# EasyEDA Pro project E-SportsV0.2.epro, schematic Schematic2_1
Board Name: Board2_1; Create Date: 2025-07-02; Page Name: P1; Project Name: E-SportsV0.2; Schematic Name: Schematic2_1; Update Date: 2025-07-02; Company: 嘉立创EDA; Page Size: A4; Version: V1.0
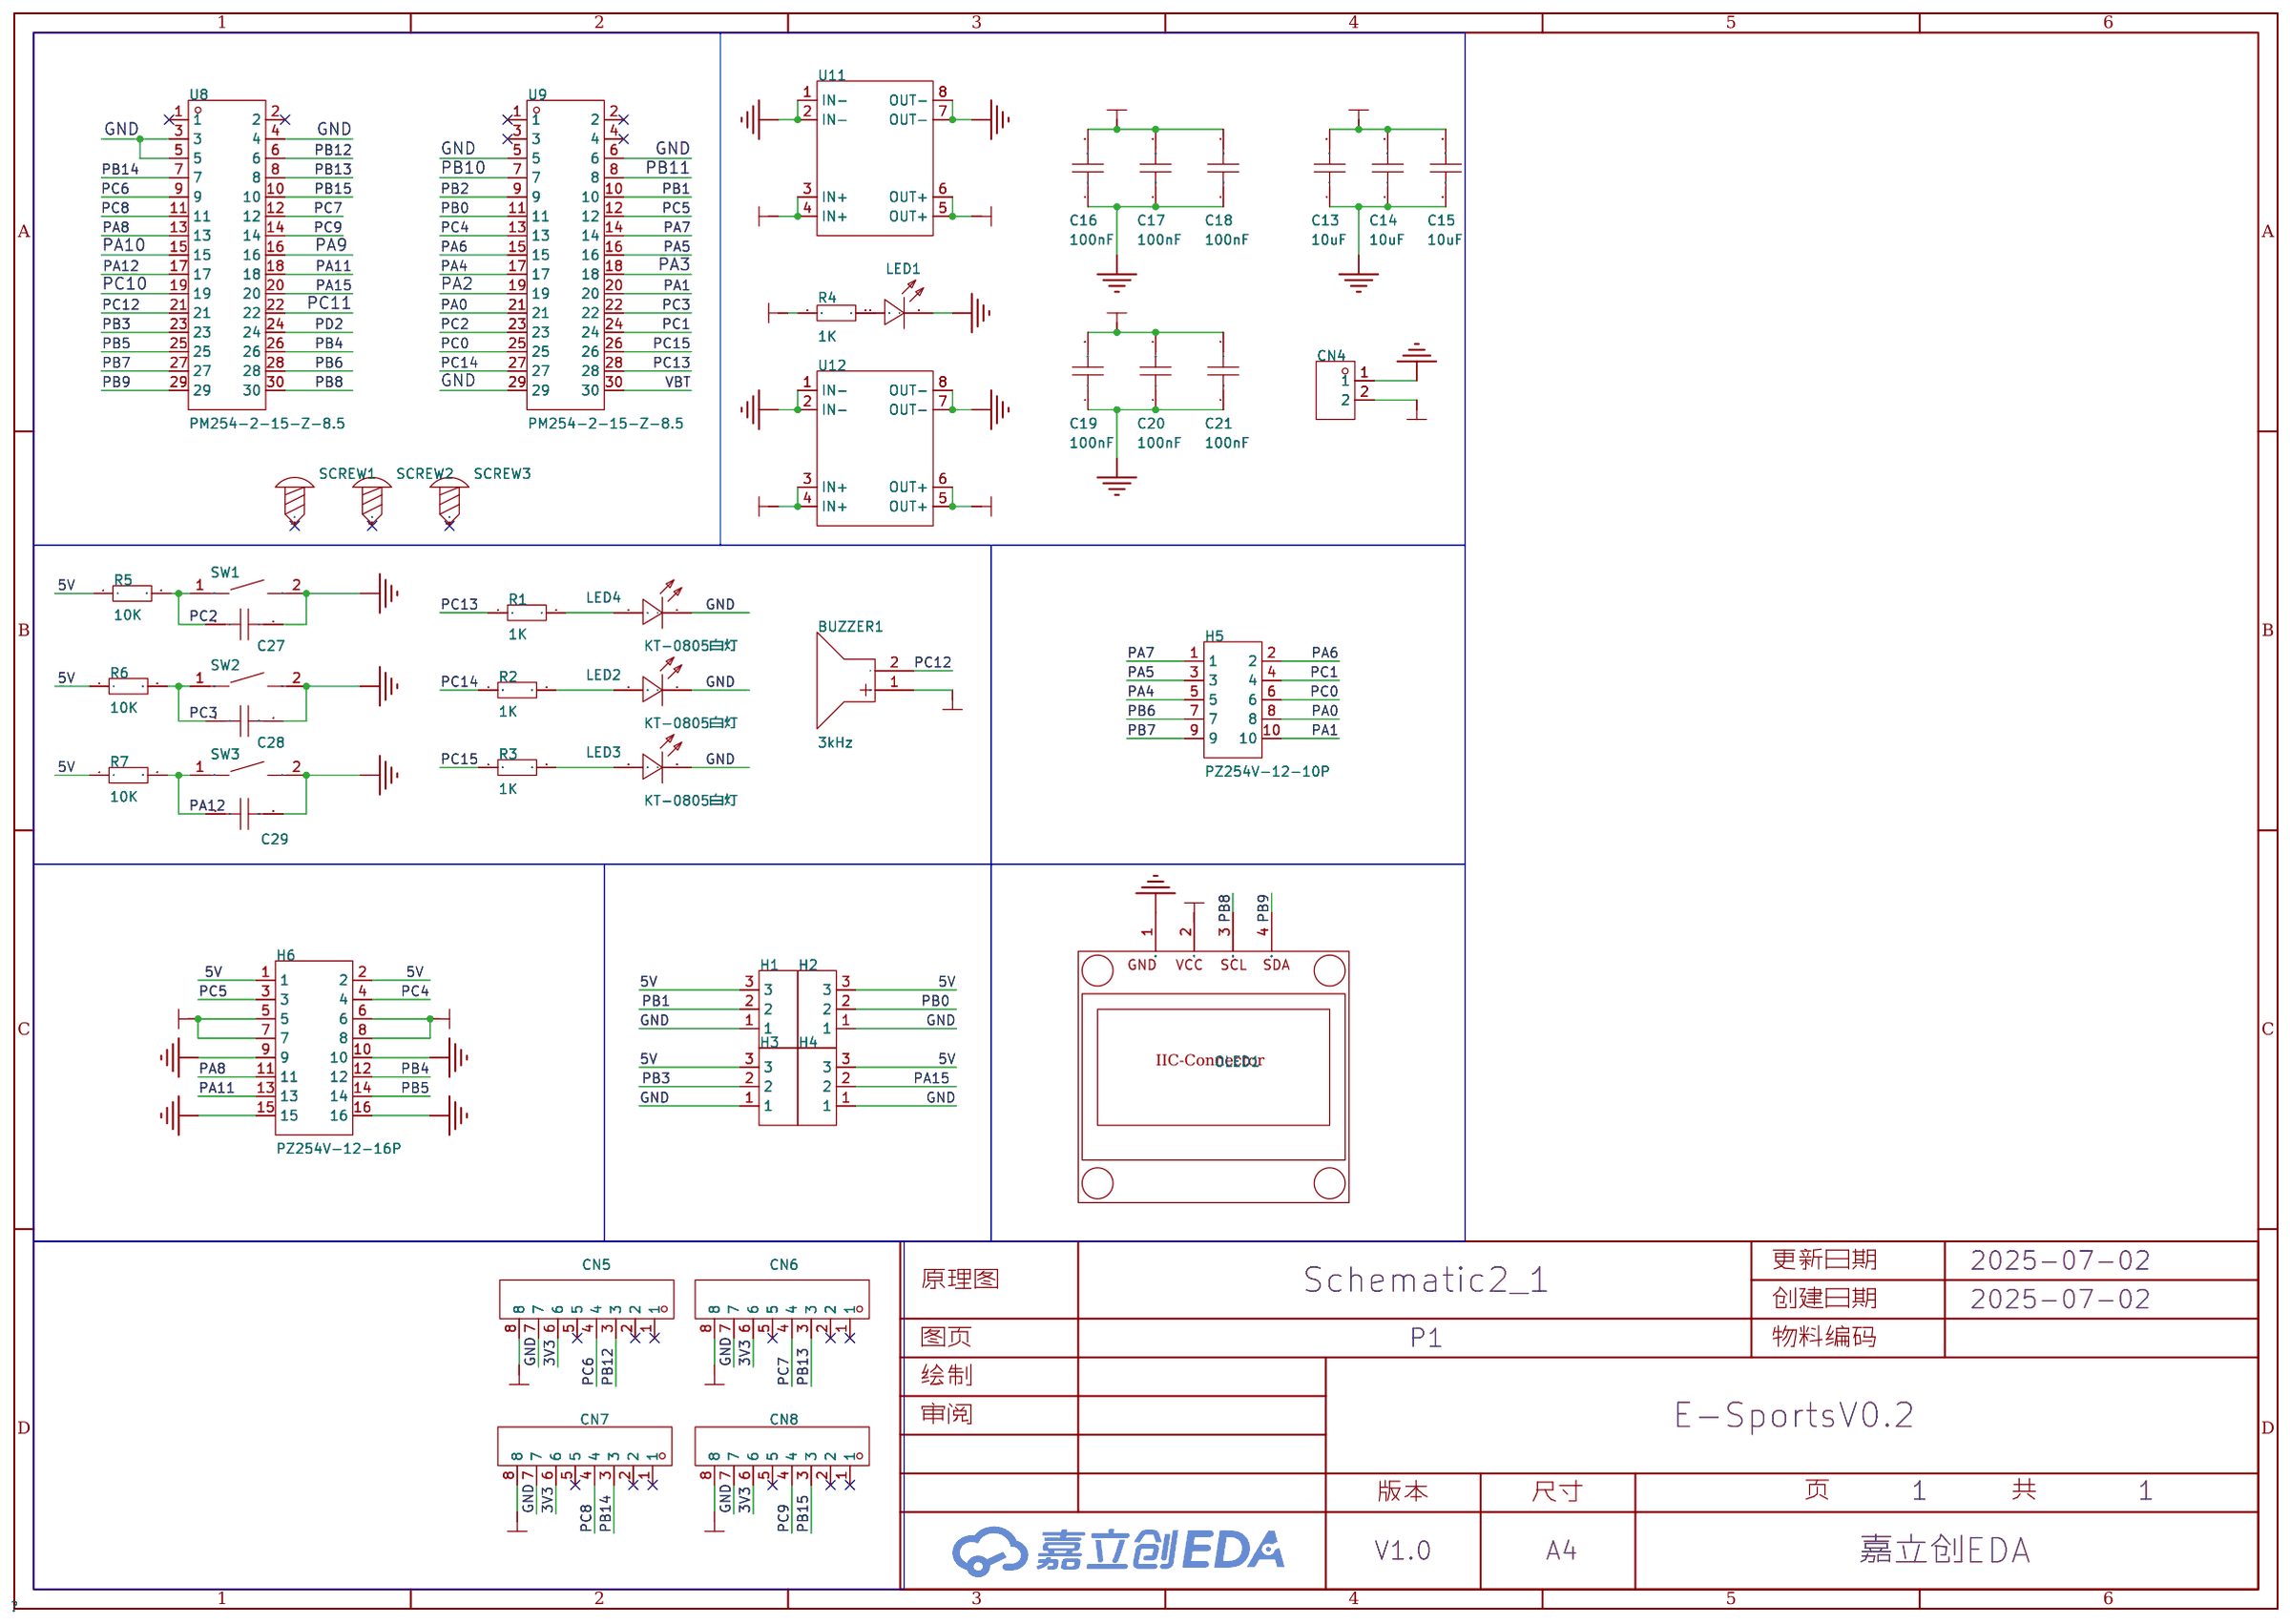
[diagram p1: schematic sheet]

## Parts
BUZZER1  3kHz  [BUZ-TH_BD9.0-P5.00-D0.6-FD]
C13  10uF  [C0805]
C14  10uF  [C0805]
C15  10uF  [C0805]
C16  100nF  [C0603]
C17  100nF  [C0603]
C18  100nF  [C0603]
C19  100nF  [C0603]
C20  100nF  [C0603]
C21  100nF  [C0603]
C27  100nF  [C0603]
C28  100nF  [C0603]
C29  100nF  [C0603]
CN4  DB2ERC-3.81-2P-GN  [CONN-TH_2P-P3.81_DB2ERC-3.81-2P]
CN5  ZX-XH2.54-8PZZ  [CONN-TH_8P-P2.50-XH2.54-8P]
CN6  ZX-XH2.54-8PZZ  [CONN-TH_8P-P2.50-XH2.54-8P]
CN7  ZX-XH2.54-8PZZ  [CONN-TH_8P-P2.50-XH2.54-8P]
CN8  ZX-XH2.54-8PZZ  [CONN-TH_8P-P2.50-XH2.54-8P]
H1  PZ254V-11-03P  [HDR-TH_3P-P2.54-V-M]
H2  PZ254V-11-03P  [HDR-TH_3P-P2.54-V-M]
H3  PZ254V-11-03P  [HDR-TH_3P-P2.54-V-M]
H4  PZ254V-11-03P  [HDR-TH_3P-P2.54-V-M]
H5  PZ254V-12-10P  [HDR-TH_10P-P2.54-V-M-R2-C5-S2.54]
H6  PZ254V-12-16P  [HDR-TH_16P-P2.54-V-M-R2-C8-S2.54]
LED1  KT-0805W  [LED0805-R-RD]
LED2  KT-0805白灯  [LED0805-R-RD]
LED3  KT-0805白灯  [LED0805-R-RD]
LED4  KT-0805白灯  [LED0805-R-RD]
OLED1  0.96OLED_4P_MODULE_JX  [0.96OLED_4P]
R1  1K  [R0603]
R2  1K  [R0603]
R3  1K  [R0603]
R4  1K  [R0603]
R5  10K  [R0603]
R6  10K  [R0603]
R7  10K  [R0603]
SCREW1  -  [M3螺丝]
SCREW2  -  [M3螺丝]
SCREW3  -  [M3螺丝]
SW1  TS-1088-AR02016  [SW-SMD_L3.9-W3.0-P4.45]
SW2  TS-1088-AR02016  [SW-SMD_L3.9-W3.0-P4.45]
SW3  TS-1088-AR02016  [SW-SMD_L3.9-W3.0-P4.45]
U8  PM254-2-15-Z-8.5  [HDR-TH_30P-P2.54-V-F-R2-C15-S2.54-2]
U9  PM254-2-15-Z-8.5  [HDR-TH_30P-P2.54-V-F-R2-C15-S2.54-2]
U11  -  [MP1584模块]
U12  -  [MP1584模块]

## Library data of the parts
BUZZER1 = HNB09A03: 驱动方式:有源(内含驱动线路);构造类型:电磁式;频率:3kHz;声压(SPL):85dB;; LCSC Part Name: 电磁式有源一体蜂鸣器HNB09A03; Supplier Part: C96102; Manufacturer: 华能; Supplier Footprint: 插件,D=9mm; JLCPCB Part Class: 扩展库; Datasheet: https://atta.szlcsc.com/upload/public/pdf/source/20241128/61C4C8C3938BB25F7C38FBE94CCE8DCF.pdf; Supplier: LCSC; Driver Circuitry: 有源(内含驱动线路); Technology: 电磁式; Voltage - Supply: 1.5V~4.5V; Current Consumption: 30mA; Sound Pressure Level(SPL): 85dB; Diameter(φD): 9mm; Height: 5.5mm; Operating Temperature: -20℃~+70℃
C13-C15 = CL21A106KAYNNNE_C15850: 容值:10uF;精度:±10%;额定电压:25V;材质(温度系数):X5R;; LCSC Part Name: 10uF ±10% 25V; Supplier Part: C15850; Manufacturer: SAMSUNG(三星); Manufacturer Part: CL21A106KAYNNNE; Supplier Footprint: 0805; JLCPCB Part Class: 基础库; Datasheet: https://atta.szlcsc.com/upload/public/pdf/source/20160218/1457707763339.pdf; Supplier: LCSC; Tolerance: ±10%; Voltage Rated: 25V; Temperature Coefficient: X5R
C16-C21 C27-C29 = CAP_0603: Supplier Footprint: 0603
CN4 = DB2ERC-3.81-2P-GN: 连接器类型:板端/插座-闭口;结构:1x2P;间距:3.81mm;颜色:绿色;安装方式:弯针;排数:1;每排PIN数:2;额定电流:10A;额定电压:250V;工作温度范围:-40℃~+105℃;; LCSC Part Name: 3.81mm 1x2P 排数:1 每排P数:2; Supplier Part: C395684; Manufacturer: DORABO(地博电气); Supplier Footprint: 弯插,P=3.81mm; JLCPCB Part Class: 扩展库; Datasheet: https://atta.szlcsc.com/upload/public/pdf/source/20221115/4E217E7D538220F8720C137D6A05E519.pdf; Supplier: LCSC; Connector Type: 板端/插座-闭口; Structure: 1x2P; Pitch: 3.81mm; Color: 绿色; Mounting Style: 弯针; Number of Pins: 2P; Number of Rows: 1; Number of PINs Per Row: 2; Current Rating (Max): 10A; Voltage Rating (Max): 250V; Operating Temperature Range: -40℃~+105℃
CN5-CN8 = ZX-XH2.54-8PZZ: 插针结构:1x8P;间距:2.5mm;安装方式:直插;参考系列:XH;总PIN数:8P;排数:1;每排PIN数:8;行距:-;额定电流:3A;触头材质:黄铜;触头镀层:锡;工作温度范围:-25℃~+85℃;; LCSC Part Name: 1x8P 间距:2.5mm 直插 系列:XH; Supplier Part: C7429638; Manufacturer: Megastar(兆星); Supplier Footprint: 插件,P=2.5mm; Datasheet: https://atta.szlcsc.com/upload/public/pdf/source/20230619/688603DEA58996C00B1F33C46797D2C3.pdf; Supplier: LCSC; Pins Structure: 1x8P; Pitch: 2.5mm; Mounting Type: 直插; Reference Series: XH; Number of Pins: 8P; Number of Rows: 1; Number of PINs Per Row: 8; Rated Current: 3A; Contact Material: 黄铜; Contact Plating: 锡; Operating Temperature: -25℃~+85℃; Rated Voltage (Max): 250V; Plastic Material: PA66; Flame Retardant Rating: UL94V-0; Color: 白色; Z-Height of the Board: 7mm; X-Length of Bottom Edge on Board (Spacing Line): 22.5mm; Y-Width of Bottom Edge on Board: 5.9mm
H1-H4 = PZ254V-11-03P: 插针结构:1x3P;间距:2.54mm;行距:-;圆针/方针:方针;安装方式:直插;排数:单排;总PIN位数:3P;额定电流:3A;额定电压:250V;配合针长度:6mm;塑高:2.5mm;端接针长度:3mm;工作温度:-40℃~+105℃;颜色:黑色;; LCSC Part Name: 1x3P 间距:2.54mm 方针 直插; Supplier Part: C2937625; Manufacturer: XFCN(兴飞); Supplier Footprint: 插件,P=2.54mm; JLCPCB Part Class: 扩展库; Datasheet: https://atta.szlcsc.com/upload/public/pdf/source/20200309/C492402_8335C3D49C4E4C618838D59BB1D024C1.pdf; Supplier: LCSC; Pin Structure: 1x3P; Pitch: 2.54mm; Circluar Pins/Square Pins: 方针; Mounting Type: 直插; Number of Rows: 单排; Number of Pins: 3P; Current Rating: 3A; Voltage Rating (Max): 250V; Length of Mating Pin: 6mm; Insulation Height: 2.5mm; Length of End Connection Pin: 3mm; Operating Temperature: -40℃~+105℃; Color: 黑色
H5 = PZ254V-12-10P: 插针结构:2x5P;间距:2.54mm;行距:2.54mm;圆针/方针:方针;安装方式:直插;排数:双排;总PIN位数:10P;额定电流:-;额定电压:-;配合针长度:6mm;塑高:2.5mm;端接针长度:3mm;触头材质:黄铜;触头镀层:-;工作温度:-40℃~+105℃;颜色:黑色;; LCSC Part Name: 2x5P 间距:2.54mm 方针 直插; Supplier Part: C492422; Manufacturer: XFCN(兴飞); Supplier Footprint: 插件,P=2.54mm; JLCPCB Part Class: 扩展库; Datasheet: https://atta.szlcsc.com/upload/public/pdf/source/20200309/C492422_5020CEA01BE7051F9EA9DD81AB0A25E3.pdf; Supplier: LCSC; Pin Structure: 2x5P; Pitch: 2.54mm; Row Spacing: 2.54mm; Circluar Pins/Square Pins: 方针; Mounting Type: 直插; Number of Rows: 双排; Number of Pins: 10P; Length of Mating Pin: 6mm; Insulation Height: 2.5mm; Length of End Connection Pin: 3mm; Contact Material: 黄铜; Operating Temperature: -40℃~+105℃; Color: 黑色
H6 = PZ254V-12-16P: 插针结构:2x8P;间距:2.54mm;行距:2.54mm;圆针/方针:方针;安装方式:直插;排数:双排;总PIN位数:16P;额定电流:-;额定电压:-;配合针长度:6mm;塑高:2.5mm;端接针长度:3mm;触头材质:黄铜;触头镀层:-;工作温度:-40℃~+105℃;颜色:黑色;; LCSC Part Name: 2x8P 间距:2.54mm 方针 直插; Supplier Part: C492425; Manufacturer: XFCN(兴飞); Supplier Footprint: 插件,P=2.54mm; JLCPCB Part Class: 扩展库; Datasheet: https://atta.szlcsc.com/upload/public/pdf/source/20200309/C492425_0A00EE06259AD0A0AB9C88167BB69964.pdf; Supplier: LCSC; Pin Structure: 2x8P; Pitch: 2.54mm; Row Spacing: 2.54mm; Circluar Pins/Square Pins: 方针; Mounting Type: 直插; Number of Rows: 双排; Number of Pins: 16P; Length of Mating Pin: 6mm; Insulation Height: 2.5mm; Length of End Connection Pin: 3mm; Contact Material: 黄铜; Operating Temperature: -40℃~+105℃; Color: 黑色
LED1 = KT-0805W: 色温6000K左右; LCSC Part Name: 0805 白灯 高亮; Supplier Part: C34499; Manufacturer: KENTO; Supplier Footprint: 0805; JLCPCB Part Class: 基础库; Datasheet: https://atta.szlcsc.com/upload/public/pdf/source/20221124/DAA20402FFC1FB071B8B6797757426FE.pdf; Supplier: LCSC
LED2-LED4 = LED0805: LCSC Part Name: 0805白灯（300-360mcd); Supplier Part: C34499; Manufacturer: KENTO; Supplier Footprint: 0805; JLCPCB Part Class: 基础库; Datasheet: https://atta.szlcsc.com/upload/public/pdf/source/20221124/DAA20402FFC1FB071B8B6797757426FE.pdf; Supplier: LCSC
OLED1 = 0.96OLED_4P_MODULE_JX: Supplier Part: C9900004566; Supplier Footprint: 插件; JLCPCB Part Class: 扩展库; Datasheet: https://atta.szlcsc.comnull; Supplier: LCSC
R1-R7 = Res_0603: Supplier Footprint: 0603
SCREW1-SCREW3 = M3螺丝: Supplier Footprint: 插件
SW1-SW3 = TS-1088-AR02016: 电路结构:单刀单掷;按钮形状:圆形按钮;作用力:160gf;安装方式:立贴;开关长度:4mm;开关宽度:3mm;开关高度:2mm;带支架:不带;触点电流:50mA;额定电压(DC):12V;绝缘电阻:100MΩ;机械寿命:10万次;; LCSC Part Name: 4*3*2mm 立贴 轻触开关; Supplier Part: C720477; Manufacturer: XUNPU(讯普); Supplier Footprint: SMD; JLCPCB Part Class: 基础库; Datasheet: https://atta.szlcsc.com/upload/public/pdf/source/20200810/C720475_60D09DD6C54279ADDB2DC25100F1CC11.pdf; Supplier: LCSC; Circuit: 单刀单掷; Actuator Style: 圆形按钮; Operating Force: 160gf; Mounting Style: 立贴; Switch Length: 4mm; Switch Width: 3mm; Switch Height: 2mm; Strike Gundam: 不带; Contact Current: 50mA; Voltage Rating (DC): 12V; Insulation Resistance: 100MΩ; Actuator/Cap Color: 黑色; Pin Style: SMD接片; Mechanical Life: 10万次; Operating Temperature: -30℃~+80℃
U8 U9 = PM254-2-15-Z-8.5: 插孔结构:2x15P;间距:2.54mm;行距:2.54mm;圆孔/方孔:方孔;安装类型:直插;排数:双排;总孔位数:30P;额定电流:3A;额定电压:-;插孔方向:顶部;塑高:8.5mm;触头材质:铜合金;工作温度范围:-40℃~+105℃;焊接温度(最大值):260℃@5S;; LCSC Part Name: 2x15P 间距:2.54mm 直插; Supplier Part: C2897416; Manufacturer: HCTL(华灿天禄); Supplier Footprint: 插件,P=2.54mm; JLCPCB Part Class: 扩展库; Datasheet: https://atta.szlcsc.com/upload/public/pdf/source/20230609/3D36CA2C1BFC9FD1C3F709AD9DFEB9C2.pdf; Supplier: LCSC; Holes Structure: 2x15P; Pitch: 2.54mm; Row Spacing: 2.54mm; Circular Hole / Square Hole: 方孔; Mounting Type: 直插; Number of Rows: 双排; Number of Holes: 30P; Current Rating (Max): 3A; Holes Direction: 顶部; Insulation Height: 8.5mm; Contact Material: 铜合金; Operating Temperature Range: -40℃~+105℃; Soldering Temperature(Max): 260℃@5S
U11 U12 = MP1584EN: MP1584EN降压至3.3V模块

## Nets
3V3: BUZZER1.1(+) C16.2 C17.2 C18.2 CN5.6 CN6.6 CN7.6 CN8.6 H6.5 H6.6 H6.7 H6.8 R4.1 U12.5(OUT+) U12.6(OUT+)
5V: C19.2 C20.2 C21.2 H1.3 H2.3 H3.3 H4.3 H6.1 H6.2 OLED1.2(VCC) R5.1 R6.1 R7.1 U11.5(OUT+) U11.6(OUT+) U12.3(IN+) U12.4(IN+)
12V: C13.2 C14.2 C15.2 CN4.2 CN5.8 CN6.8 CN7.8 CN8.8 U11.3(IN+) U11.4(IN+)
GND: C13.1 C14.1 C15.1 C16.1 C17.1 C18.1 C19.1 C20.1 C21.1 C27.2 C28.2 C29.2 CN4.1 CN5.7 CN6.7 CN7.7 CN8.7 H1.1 H2.1 H3.1 H4.1 H6.9 H6.10 H6.15 H6.16 LED1.2(K) LED2.2(K) LED3.2(K) LED4.2(K) OLED1.1(GND) SW1.2 SW2.2 SW3.2 U8.3 U8.4 U8.5 U9.5 U9.6 U9.29 U11.1(IN-) U11.2(IN-) U11.7(OUT-) U11.8(OUT-) U12.1(IN-) U12.2(IN-) U12.7(OUT-) U12.8(OUT-)
PA0: H5.8 U9.21
PA1: H5.10 U9.20
PA2: U9.19
PA3: U9.18
PA4: H5.5 U9.17
PA5: H5.3 U9.16
PA6: H5.2 U9.15
PA7: H5.1 U9.14
PA8: H6.11 U8.13
PA9: U8.16
PA10: U8.15
PA11: H6.13 U8.18
PA12: C29.1 R7.2 SW3.1 U8.17
PA15: H4.2 U8.20
PB0: H2.2 U9.11
PB1: H1.2 U9.10
PB2: U9.9
PB3: H3.2 U8.23
PB4: H6.12 U8.26
PB5: H6.14 U8.25
PB6: H5.7 U8.28
PB7: H5.9 U8.27
PB8: OLED1.3(SCL) U8.30
PB9: OLED1.4(SDA) U8.29
PB10: U9.7
PB11: U9.8
PB12: CN5.3 U8.6
PB13: CN6.3 U8.8
PB14: CN7.3 U8.7
PB15: CN8.3 U8.10
PC0: H5.6 U9.25
PC1: H5.4 U9.24
PC2: C27.1 R5.2 SW1.1 U9.23
PC3: C28.1 R6.2 SW2.1 U9.22
PC4: H6.4 U9.13
PC5: H6.3 U9.12
PC6: CN5.4 U8.9
PC7: CN6.4 U8.12
PC8: CN7.4 U8.11
PC9: CN8.4 U8.14
PC10: U8.19
PC11: U8.22
PC12: BUZZER1.2(-) U8.21
PC13: R1.1 U9.28
PC14: R2.1 U9.27
PC15: R3.1 U9.26
PD2: U8.24
VBT: U9.30
$1N6555: LED1.1(A) R4.2
$1N8963: LED4.1(A) R1.2
$1N8970: LED2.1(A) R2.2
$1N8971: LED3.1(A) R3.2

Not connected (* = marked no-connect by the designer): CN5 1* 2* 5*; CN6 1* 2* 5*; CN7 1* 2* 5*; CN8 1* 2* 5*; SCREW1 1*; SCREW2 1*; SCREW3 1*; U8 1* 2*; U9 1* 2* 3* 4*
